# Altium project COMS0005_Coms_Test_Board.PrjPCB
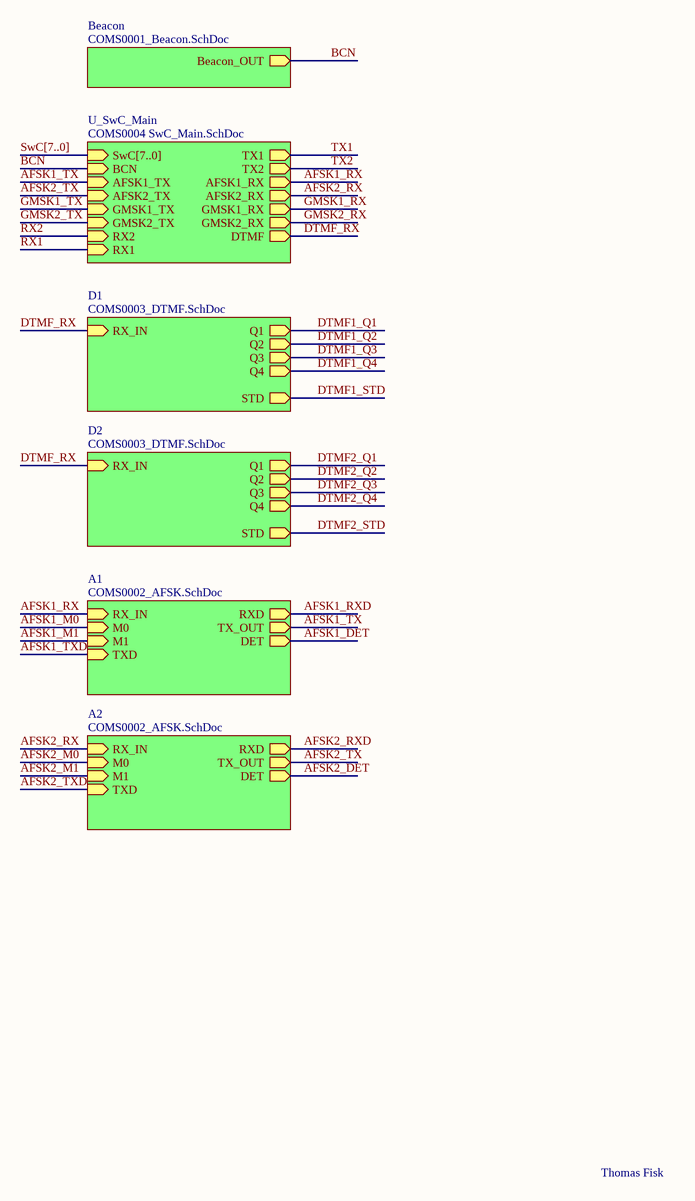
[diagram p0: COMS0010_Comms_Test_Board.SchDoc]
2 sheets, 10 parts. Net scope: hierarchical (ports join the sheet entries above them; power ports are global).
Sheets:
  COMS0010_Comms_Test_Board.SchDoc
    U_SwC_Main = COMS0004 SwC_Main.SchDoc

## Sheet COMS0010_Comms_Test_Board.SchDoc: BLUEsat Communications Test Board
size A3; DrawnBy: Thomas Fisk; Engineer: T. FISK; Organization: BLUEsat Project; Address1: Room 419; Address2: School of EE&T; Address3: UNSW, NSW 2052; Address4: Australia; DocumentNumber: COMS0005; SheetNumber: 1; SheetTotal: 1; Description: Test board for communications subsystem.; Version: 1.0

### Sub-sheets
A1 = COMS0002_AFSK.SchDoc (file not in this document): RX_IN (in), M0 (in), M1 (in), TXD (in), RXD (out), TX_OUT (out), DET (out)
A2 = COMS0002_AFSK.SchDoc (file not in this document): RX_IN (in), M0 (in), M1 (in), TXD (in), RXD (out), TX_OUT (out), DET (out)
Beacon = COMS0001_Beacon.SchDoc (file not in this document): Beacon_OUT (out)
D1 = COMS0003_DTMF.SchDoc (file not in this document): Q1 (out), RX_IN (in), STD (out), Q2 (out), Q3 (out), Q4 (out)
D2 = COMS0003_DTMF.SchDoc (file not in this document): Q1 (out), RX_IN (in), STD (out), Q2 (out), Q3 (out), Q4 (out)
U_SwC_Main = COMS0004 SwC_Main.SchDoc: SwC[7..0] (in), BCN (in), AFSK1_TX (in), AFSK2_TX (in), GMSK1_TX (in), GMSK2_TX (in), TX1 (out), TX2 (out), RX2 (in), RX1 (in), AFSK1_RX (out), AFSK2_RX (out), GMSK1_RX (out), GMSK2_RX (out), DTMF (out)

### Nets
AFSK1_DET: sheet A1/DET
AFSK1_M0: sheet A1/M0
AFSK1_M1: sheet A1/M1
AFSK1_RX: sheet U_SwC_Main/AFSK1_RX, sheet A1/RX_IN
AFSK1_RXD: sheet A1/RXD
AFSK1_TX: sheet U_SwC_Main/AFSK1_TX, sheet A1/TX_OUT
AFSK1_TXD: sheet A1/TXD
AFSK2_DET: sheet A2/DET
AFSK2_M0: sheet A2/M0
AFSK2_M1: sheet A2/M1
AFSK2_RX: sheet U_SwC_Main/AFSK2_RX, sheet A2/RX_IN
AFSK2_RXD: sheet A2/RXD
AFSK2_TX: sheet U_SwC_Main/AFSK2_TX, sheet A2/TX_OUT
AFSK2_TXD: sheet A2/TXD
BCN: sheet Beacon/Beacon_OUT, sheet U_SwC_Main/BCN
DTMF1_Q1: sheet D1/Q1
DTMF1_Q2: sheet D1/Q2
DTMF1_Q3: sheet D1/Q3
DTMF1_Q4: sheet D1/Q4
DTMF1_STD: sheet D1/STD
DTMF2_Q1: sheet D2/Q1
DTMF2_Q2: sheet D2/Q2
DTMF2_Q3: sheet D2/Q3
DTMF2_Q4: sheet D2/Q4
DTMF2_STD: sheet D2/STD
DTMF_RX: sheet U_SwC_Main/DTMF, sheet D1/RX_IN, sheet D2/RX_IN
GMSK1_RX: sheet U_SwC_Main/GMSK1_RX
GMSK1_TX: sheet U_SwC_Main/GMSK1_TX
GMSK2_RX: sheet U_SwC_Main/GMSK2_RX
GMSK2_TX: sheet U_SwC_Main/GMSK2_TX
RX1: sheet U_SwC_Main/RX1
RX2: sheet U_SwC_Main/RX2
TX1: sheet U_SwC_Main/TX1
TX2: sheet U_SwC_Main/TX2

### Buses and harness runs
bus SwC[7..0] = sheet U_SwC_Main/SwC[7..0]

### Notes on the sheet
- Thomas Fisk
- Title
- Description:
- Size:
- Author:
- Date:
- A3
- Time:
- Version
- Sheet:
- Drawing No.:
- of
- File:

## Sheet COMS0004 SwC_Main.SchDoc: BLUEsat Switching Circuit Overview
size A3; Engineer: D. JEDRYCHOWSKI; Organization: BLUEsat Project; Address1: Room 419; Address2: School of EE&T; Address3: UNSW, NSW 2052; Address4: Australia; DocumentNumber: COMS0004; SheetNumber: 1; SheetTotal: 4; Description: Overview of Switching Circuit; Version: 1.0
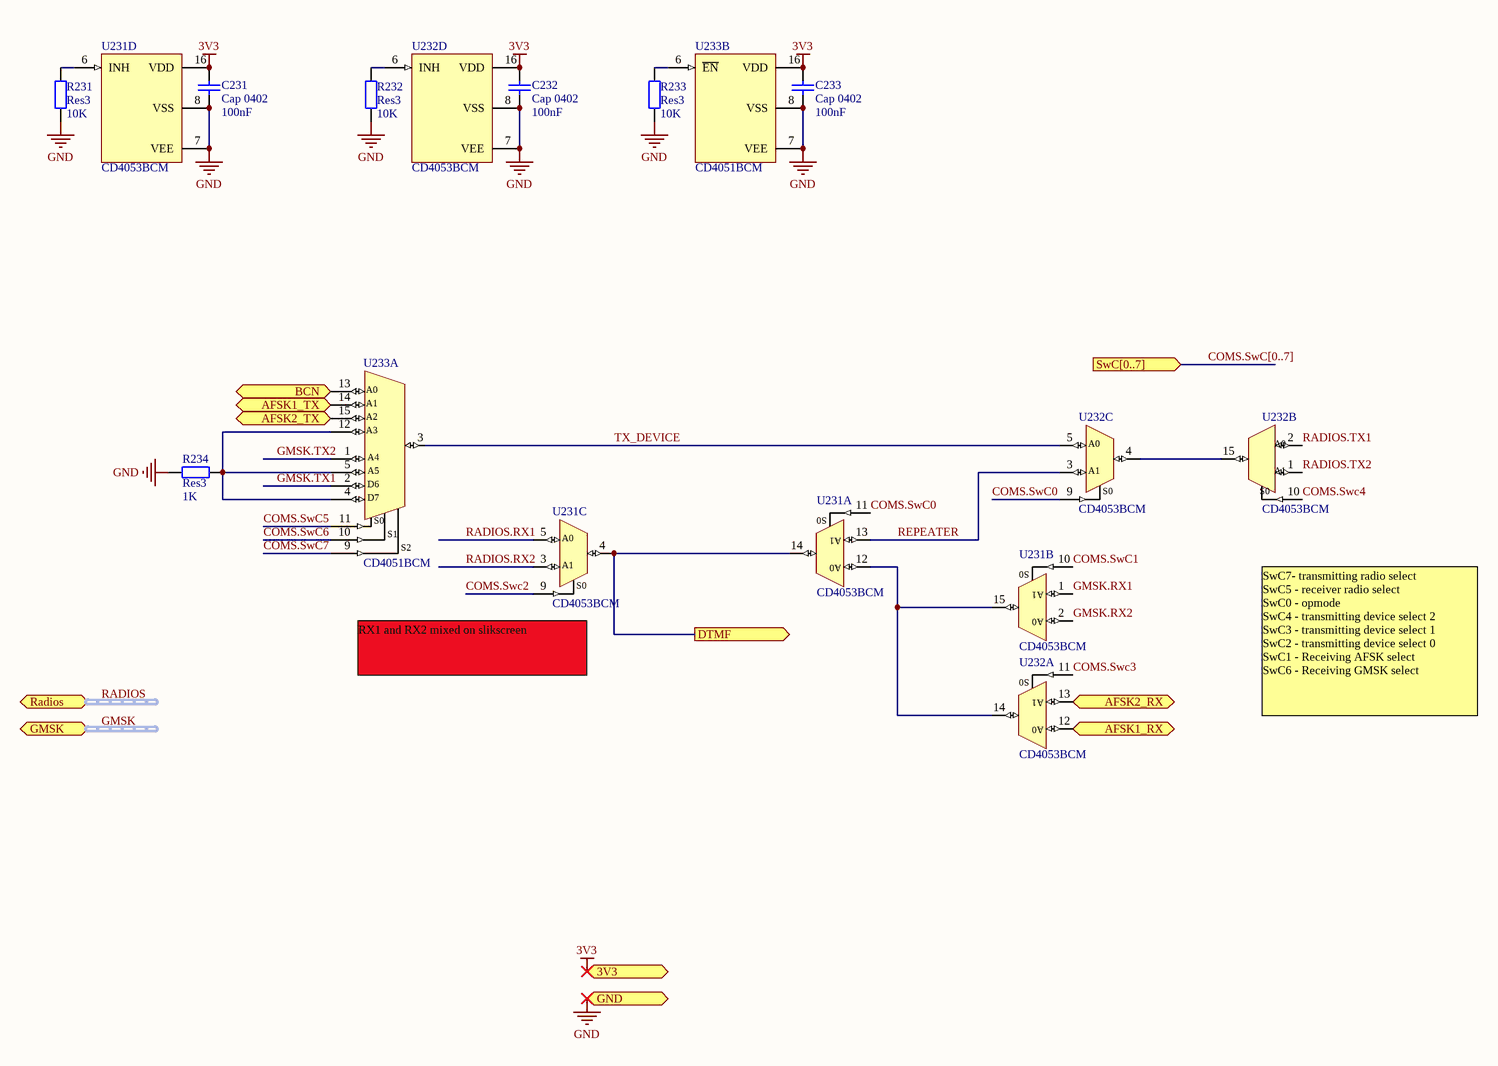
[diagram p1: COMS0004 SwC_Main.SchDoc]

### Parts
C231  Cap 0402  value 100nF  [CAPC1005X06L]
C232  Cap 0402  value 100nF  [CAPC1005X06L]
C233  Cap 0402  value 100nF  [CAPC1005X06L]
R231  Res3  value 10K  [RESC1005X06L]
R232  Res3  value 10K  [RESC1005X06L]
R233  Res3  value 10K  [RESC1005X06L]
R234  Res3  value 1K  [RESC1005X06L]
U231  CD4053BCM  [TSSOP16]  (parts A,B,C,D of 4)
U232  CD4053BCM  [TSSOP16]  (parts A,B,C,D of 4)
U233  CD4051BCM  [TSSOP16]  (parts A,B of 2)

### Ports
3V3 (in), AFSK1_RX (out), AFSK1_TX (in), AFSK2_RX (out), AFSK2_TX (in), BCN (in), DTMF (out), GMSK (harness GMSK), GND (in), Radios (harness RADIOS), SwC[0..7] (in)

### Nets
3V3: C231.2 C232.2 C233.2 U231.16(VDD) U232.16(VDD) U233.16(VDD) ; port 3V3
GND: C231.1 C232.1 C233.1 R231.2 R232.2 R233.2 R234.1 U231.7(VEE) U231.8(VSS) U232.7(VEE) U232.8(VSS) U233.7(VEE) U233.8(VSS) ; port GND
AFSK1_RX: U232.12(A0) ; port AFSK1_RX
AFSK1_TX: U233.14(A1) ; port AFSK1_TX
AFSK2_RX: U232.13(A1) ; port AFSK2_RX
AFSK2_TX: U233.15(A2) ; port AFSK2_TX
BCN: U233.13(A0) ; port BCN
COMS.SwC0: U231.11(A) U232.9(C)
COMS.SwC1: U231.10(B)
COMS.Swc2: U231.9(C)
COMS.Swc3: U232.11(A)
COMS.Swc4: U232.10(B)
COMS.SwC5: U233.11(S0)
COMS.SwC6: U233.10(S1)
COMS.SwC7: U233.9(S2)
DTMF_RX: U231.4(c_out) U231.14(A_out) ; port DTMF
GMSK.RX1: U231.1(by)
GMSK.RX2: U231.2(bx)
GMSK.TX1: U233.2(A6)
GMSK.TX2: U233.1(A4)
RADIOS.RX1: U231.5(cx)
RADIOS.RX2: U231.3(cy)
RADIOS.TX1: U232.2(bx)
RADIOS.TX2: U232.1(by)
REPEATER: U231.13(A1) U232.3(cy)
TX_DEVICE: U232.5(cx) U233.3(O)
NetR231_1: R231.1 U231.6(INH)
NetR232_1: R232.1 U232.6(INH)
NetR233_1: R233.1 U233.6(~{EN})
NetR234_2: R234.2 U233.4(A7) U233.5(A5) U233.12(A3)
NetU231_12: U231.12(A0) U231.15(b_out) U232.14(A_out)
NetU232_4: U232.4(c_out) U232.15(b_out)

### Buses and harness runs
bus COMS.SwC[0..7] = port SwC[0..7]
harness GMSK = port GMSK
harness RADIOS = port Radios

### Notes on the sheet
- (near U231) RX1 and RX2 mixed on slikscreen
- SwC7- transmitting radio select
  SwC5 - receiver radio select
  SwC0 - opmode
  SwC4 - transmitting device select 2
  SwC3 - transmitting device select 1
  SwC2 - transmitting device select 0
  SwC1 - Receiving AFSK select
  SwC6 - Receiving GMSK select
- Title
- Description:
- Size:
- Author:
- Date:
- A3
- Time:
- Version
- Sheet:
- Drawing No.:
- of
- File:
- (in symbol CD4051BCM, part A) D6; D7
- (in symbol CD4053BCM, part A) S0
- (in symbol CD4053BCM, part B) S0
- (in symbol CD4053BCM, part C) S0

### Library data of the parts
C231-C233 = Cap 0402: Capacitor; Published: 8-Jun-2000; LatestRevisionDate: 17-Jul-2002; LatestRevisionNote: Re-released for DXP Platform.; PackageReference: RAD-0.3; Publisher: Altium Limited; PackageDescription: Radial Cap, Thru-Hole; 2 Leads; 0.3 in Pin Spacing
R231-R234 = Res3: Resistor; Published: 8-Jun-2000; LatestRevisionDate: 29-May-2009; LatestRevisionNote: IPC-7351 Footprint Added.; PackageReference: J1-0603; Publisher: Altium Limited; PackageDescription: Chip Resistor
U231 U232 = CD4053BCM: Triple 2-Channnel Analog Multiplexer/Demutiplexer; Supplier 1: Farnell; Supplier Part Number 1: 2132284
U233 = CD4051BCM: 8-Channel Analog Multiplexer/Demultiplexer; Datasheet Link: http://focus.ti.com/lit/ds/symlink/cd4052b.pdf; Supplier 1: Farnell; Supplier Part Number 1: 1753421